# Altium schematic sheet CAPSTONE_5.0.SchDoc
size A; SheetNumber: 1; SheetTotal: 2
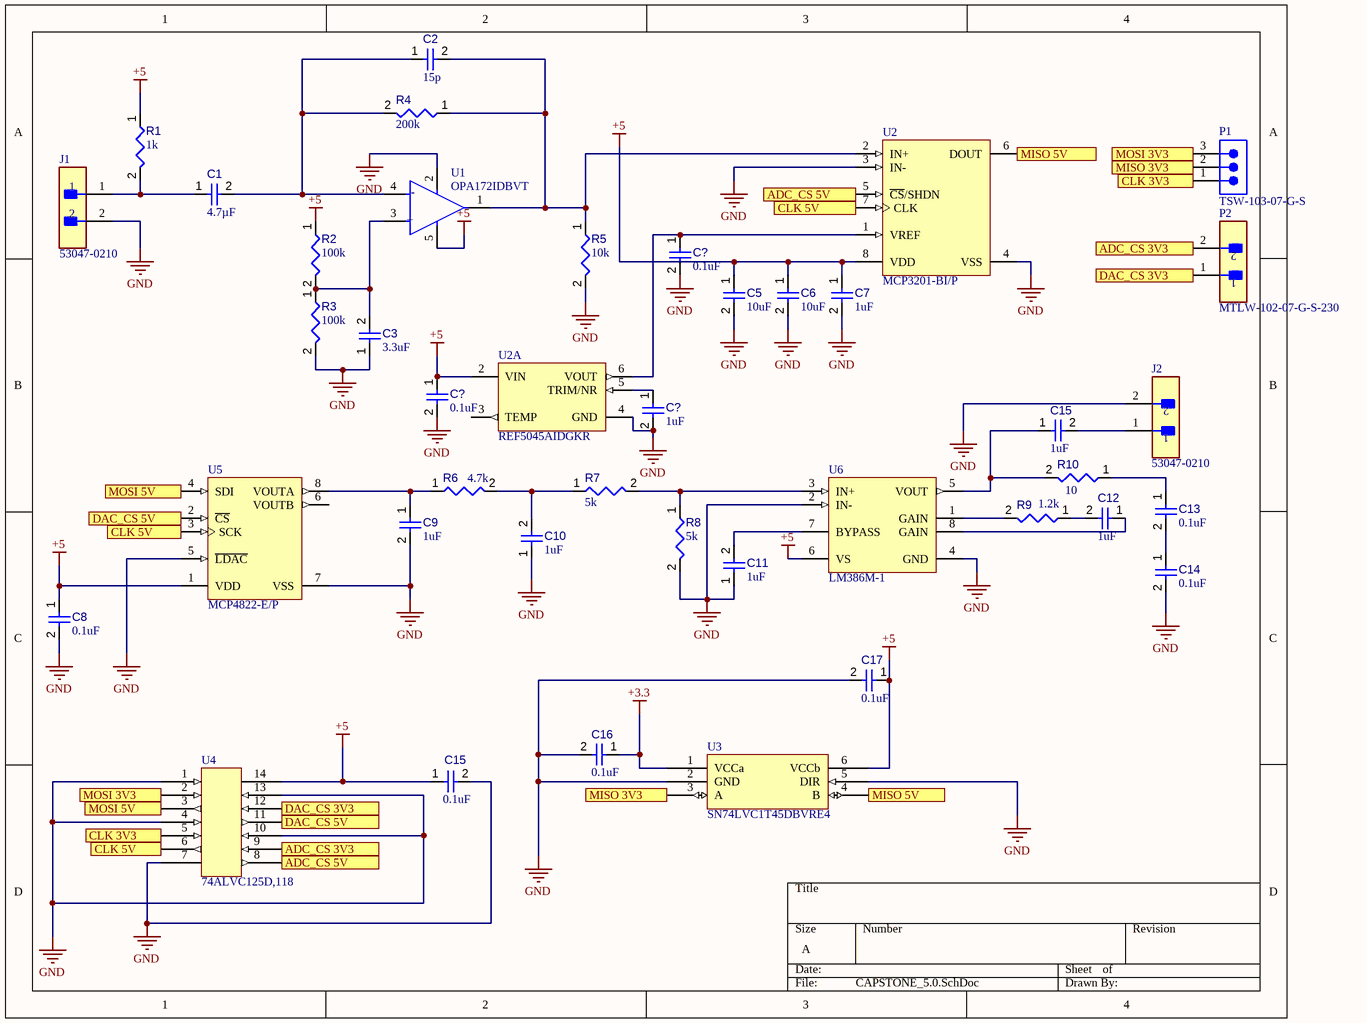
[diagram p0: CAPSTONE_5.0.SchDoc]

## Parts
(Parts that share a designator on the sheet are numbered #1, #2 ... from top to bottom, then left to right.)
C1  value 4.7µF  [CAPC0805(2012)145_L]  (hidden comment: Capacitor 4.7µF +/-40% 25V 0805)
C2  value 15p  [CAPC0805(2012)145_L]  (hidden comment: Capacitor 4.7µF +/-40% 25V 0805)
C3  value 3.3uF  [CAPC0805(2012)145_L]  (hidden comment: Capacitor 4.7µF +/-40% 25V 0805)
C5  value 10uF  [CAPC0805(2012)145_L]  (hidden comment: Capacitor 4.7µF +/-40% 25V 0805)
C6  value 10uF  [CAPC0805(2012)145_L]  (hidden comment: Capacitor 4.7µF +/-40% 25V 0805)
C7  value 1uF  [CAPC0805(2012)145_L]  (hidden comment: Capacitor 4.7µF +/-40% 25V 0805)
C8  value 0.1uF  [CAPC0805(2012)145_L]  (hidden comment: Capacitor 4.7µF +/-40% 25V 0805)
C9  value 1uF  [CAPC0805(2012)145_L]  (hidden comment: Capacitor 4.7µF +/-40% 25V 0805)
C10  value 1uF  [CAPC0805(2012)145_L]  (hidden comment: Capacitor 4.7µF +/-40% 25V 0805)
C11  value 1uF  [CAPC0805(2012)145_L]  (hidden comment: Capacitor 4.7µF +/-40% 25V 0805)
C12  value 1uF  [CAPC0805(2012)145_L]  (hidden comment: Capacitor 4.7µF +/-40% 25V 0805)
C13  value 0.1uF  [CAPC0805(2012)145_L]  (hidden comment: Capacitor 4.7µF +/-40% 25V 0805)
C14  value 0.1uF  [CAPC0805(2012)145_L]  (hidden comment: Capacitor 4.7µF +/-40% 25V 0805)
C15#1  value 1uF  [CAPC0805(2012)145_L]  (hidden comment: Capacitor 4.7µF +/-40% 25V 0805)
C15#2  value 0.1uF  [CAPC0805(2012)145_L]  (hidden comment: Capacitor 4.7µF +/-40% 25V 0805)
C16  value 0.1uF  [CAPC0805(2012)145_L]  (hidden comment: Capacitor 4.7µF +/-40% 25V 0805)
C17  value 0.1uF  [CAPC0805(2012)145_L]  (hidden comment: Capacitor 4.7µF +/-40% 25V 0805)
C?#1  value 0.1uF  [CAPC0805(2012)145_L]  (hidden comment: Capacitor 4.7µF +/-40% 25V 0805)
C?#2  value 0.1uF  [CAPC0805(2012)145_L]  (hidden comment: Capacitor 4.7µF +/-40% 25V 0805)
C?#3  value 1uF  [CAPC0805(2012)145_L]  (hidden comment: Capacitor 4.7µF +/-40% 25V 0805)
J1  53047-0210  [FP-53047-0210-MFG]
J2  53047-0210  [FP-53047-0210-MFG]
P1  TSW-103-07-G-S  [SMTC-TSW-103-07-X-S]
P2  MTLW-102-07-G-S-230  [FP-MTLW-102-07-G-S-230-MFG]
R1  value 1k  [RESC2013X70X40ML20T20]  (hidden comment: Resistor 100k +/-1% 0805 125 mW)
R2  value 100k  [RESC2013X70X40ML20T20]  (hidden comment: Resistor 100k +/-1% 0805 125 mW)
R3  value 100k  [RESC2013X70X40ML20T20]  (hidden comment: Resistor 100k +/-1% 0805 125 mW)
R4  value 200k  [RESC2013X70X40ML20T20]  (hidden comment: Resistor 100k +/-1% 0805 125 mW)
R5  value 10k  [RESC2013X70X40ML20T20]  (hidden comment: Resistor 100k +/-1% 0805 125 mW)
R6  value 4.7k  [RESC2013X70X40ML20T20]  (hidden comment: Resistor 4k7 +/-1% 0805 125 mW)
R7  value 5k  [RESC2013X70X40ML20T20]  (hidden comment: Resistor 100k +/-1% 0805 125 mW)
R8  value 5k  [RESC2013X70X40ML20T20]  (hidden comment: Resistor 100k +/-1% 0805 125 mW)
R9  value 1.2k  [RESC2013X70X40ML20T20]  (hidden comment: Resistor 100k +/-1% 0805 125 mW)
R10  value 10  [RESC2013X70X40ML20T20]  (hidden comment: Resistor 100k +/-1% 0805 125 mW)
U1  OPA172IDBVT  [FP-DBV0005A-MFG]
U2#1  MCP3201-BI/P  [PDIP300-P8]
U2#2  REF5045AIDGKR  [DGK0008A_N]  (part A of 2)
U3  SN74LVC1T45DBVRE4  [SOT65P210X110-6N]
U4  74ALVC125D,118  [SOIC127P600X175-14N]
U5  MCP4822-E/P  [PDIP300-P8]
U6  LM386M-1  [D0008A_M]

## Ports
ADC_CS 3V3 (in, see CAPSTONE_5.0[4A]), ADC_CS 3V3 (out, see CAPSTONE_5.0[1D]), ADC_CS 5V (in, see CAPSTONE_5.0[1D]), ADC_CS 5V (out, see CAPSTONE_5.0[3A]), CLK 3V3 (in, see CAPSTONE_5.0[4A]), CLK 3V3 (out, see CAPSTONE_5.0[1D]), CLK 5V (in, see CAPSTONE_5.0[1C], CAPSTONE_5.0[1D]), CLK 5V (in, see CAPSTONE_5.0[1D], CAPSTONE_5.0[3A]), CLK 5V (out, see CAPSTONE_5.0[1C], CAPSTONE_5.0[3A]), DAC_CS 3V3 (in, see CAPSTONE_5.0[4B]), DAC_CS 3V3 (out, see CAPSTONE_5.0[1D]), DAC_CS 5V (in, see CAPSTONE_5.0[1D]), DAC_CS 5V (out, see CAPSTONE_5.0[1C]), MISO 3V3 (in, see CAPSTONE_5.0[2D]), MISO 3V3 (out, see CAPSTONE_5.0[4A]), MISO 5V (in, see CAPSTONE_5.0[4A]), MISO 5V (out, see CAPSTONE_5.0[3D]), MOSI 3V3 (in, see CAPSTONE_5.0[4A]), MOSI 3V3 (out, see CAPSTONE_5.0[1D]), MOSI 5V (in, see CAPSTONE_5.0[1D]), MOSI 5V (out, see CAPSTONE_5.0[1B])

## Nets
+3.3: C16.1 U3.1(VCCa)
+5: C5.1 C6.1 C7.1 C8.1 C15#2.1 C17.1 C?#2.1 R1.1 R2.1 U1.5(V+) U2#1.8(VDD) U2#2.2(VIN) U3.6(VCCb) U4.14 U5.1(VDD) U6.6(VS)
GND: C3.1 C5.2 C6.2 C7.2 C8.2 C9.2 C10.1 C11.1 C14.2 C15#2.2 C16.2 C17.2 C?#1.2 C?#2.2 C?#3.2 J1.2 J2.2 R3.2 R5.2 R8.2 U1.2(V-) U2#1.3(IN-) U2#1.4(VSS) U2#2.4(GND) U3.2(GND) U3.5(DIR) U4.1 U4.4 U4.7 U4.10 U4.13 U5.5(~{LDAC}) U5.7(VSS) U6.2(IN-) U6.4(GND)
ADC_CS 3V3: P2.2 U4.9 ; port ADC_CS 3V3
ADC_CS 5V: U2#1.5(~{CS}/SHDN) U4.8 ; port ADC_CS 5V
CLK 3V3: P1.1 U4.5 ; port CLK 3V3
CLK 5V: U2#1.7(CLK) U4.6 U5.3(SCK) ; port CLK 5V
DAC_CS 3V3: P2.1 U4.12 ; port DAC_CS 3V3
DAC_CS 5V: U4.11 U5.2(~{CS}) ; port DAC_CS 5V
MISO 3V3: P1.2 U3.3(A) ; port MISO 3V3
MISO 5V: U2#1.6(DOUT) U3.4(B) ; port MISO 5V
MOSI 3V3: P1.3 U4.2 ; port MOSI 3V3
MOSI 5V: U4.3 U5.4(SDI) ; port MOSI 5V
NetC1_1: C1.1 J1.1 R1.2
NetC1_2: C1.2 C2.1 R4.2 U1.4(-IN)
NetC2_2: C2.2 R4.1 R5.1 U1.1(OUT) U2#1.2(IN+)
NetC3_2: C3.2 R2.2 R3.1 U1.3(+IN)
NetC9_1: C9.1 R6.1 U5.8(VOUTA)
NetC10_2: C10.2 R6.2 R7.1
NetC11_2: C11.2 U6.7(BYPASS)
NetC12_1: C12.1 U6.8(GAIN)
NetC12_2: C12.2 R9.1
NetC13_1: C13.1 R10.1
NetC13_2: C13.2 C14.1
NetC15#1_1: C15#1.1 R10.2 U6.5(VOUT)
NetC15#1_2: C15#1.2 J2.1
NetC?#1_1: C?#1.1 U2#1.1(VREF) U2#2.6(VOUT)
NetC?#3_1: C?#3.1 U2#2.5(TRIM/NR)
NetR7_2: R7.2 R8.1 U6.3(IN+)
NetR9_2: R9.2 U6.1(GAIN)

Not connected (* = marked no-connect by the designer): U2#2 3(TEMP); U5 6(VOUTB)

## Notes on the sheet
- (in symbol CMP-04893-000008-1) -; +

## Library data of the parts
C1-C3 C5-C14 C15#1 C15#2 C16 C17 C?#1-C?#3 = CMP-001-00080-4: Chip Capacitor, 4.7µF +/-40%, 25V, 0805, Thickness 1.45 mm; Tolerance: 20%; Voltage Rating: 25V; Min Operating Temperature: -55°C; Max Operating Temperature: 85°C; Pins: 2; Mounting Technology: SMT; Case/Package: 0805
J1 J2 = CMP-2000-05628-3: CONN HEADER VERT 2POS 1.25MM; Manufacturer: Molex; Conn Gender: Male; Voltage Rating: 125V; Conn Orientation: Vertical; Number Of Contacts: 2; Current Rating: 1A; Contact Material: Tin; Temperature Range Low: -40°C; ComponentLink2URL: http://www.molex.com/webdocs/datasheets/pdf/en-us/0530470210_PCB_HEADERS.pdf; Mouser Description: 1.25mm Pitch PicoBlade™ Wire-to-Board Header, Vertical, with Friction Lock, 2 Circuits; Manufacturer Part Number: 53047-0210; Temperature Range High: +85°C; ComponentLink2Description: Datasheet; Automotive: No; RoHS: TRUE; Ambient Temperature Range High: +85°C; Octopart: https://octopart.com/53047-0210-molex-276772; Footprint Url: https://www.molex.com/pdm_docs/sd/530470210_sd.pdf; Lead Free: Yes; Pitch: 1.25mm; Temperature: -40°C to +85°C; Device Class L2: Headers and Wire Housings; Package: 0; Ambient Temperature Range Low: -40°C; Digikey Description: CONN HEADER VERT 2POS 1.25MM; Category: Conn; Device Class L3: unset; Number Of Rows: 1; Device Class L1: Connectors; Height: 4.4mm
P1 = CMP-1024-00333-1: 0.025" SQ Post Header, Through-hole, Vertical, -55 to 125 degC, 2.54 mm Pitch, 3-Pin, Male, RoHS; Manufacturer: Samtec; Pitch: 2.54 mm; ComponentLink3URL: http://www.samtec.com/documents/webfiles/cpdf/TSW-XXX-XX-XXX-X-XX-XXX-MKT.pdf; Temperature Range: -55 to 125 degC; DatasheetVersion: F-214; ComponentLink1Description: Manufacturer URL; ComponentLink2URL: http://www.samtec.com/documents/webfiles/pdf/TSW_TH.PDF; RoHS: True; Orientation: Vertical; ComponentLink2Description: Datasheet; ComponentLink3Description: Package Specification; PackageDescription: .025[0.64] SQ. Post Terminal Strip Assembly; Mounting Technology: Through-hole; PackageVersion: DM, 8/1988; ComponentLink1URL: http://www.samtec.com; PackageReference: TSW-103-07-X-S; PartNumber: TSW-103-07-G-S
P2 = CMP-02766-001053-1: CONN HEADER VERT 2POS 2.54MM; Max Current Rating: 3A; Number of Contacts: 2; Gender: Male; Housing Color: Black; Housing Material: Polymer; Radiation Hardening: No; Min Operating Temperature: -55°C; Contact Plating: Gold; Termination: Solder; Number of Rows: 1; Max Operating Temperature: 125°C; Contact Material: Bronze; Pitch: 2.54mm; Depth: 2.48mm; Length: 5.08mm; Orientation: Straight; Packaging: Bulk
R1-R5 R7-R10 = CMP-009-00024-5: Chip Resistor, 100 KOhm, +/- 1%, 0.125 W, -55 to 155 degC, 0805 (2012 Metric); Power: 125mW; Voltage Rating: 150V; Max Operating Temperature: 155°C; Mounting Technology: SM; RoHS Compliant: True; Tolerance: 1%; Case/Package: 0805; Min Operating Temperature: -55°C; Pins: 2
R6 = CMP-009-00032-5: Chip Resistor, 4.7 KOhm, +/- 1%, 0.125 W, -55 to 155 degC, 0805 (2012 Metric); Power: 125mW; Voltage Rating: 150V; Max Operating Temperature: 155°C; Min Operating Temperature: -55°C; Case/Package: 0805; RoHS Compliant: True; Pins: 2; Tolerance: 1%; Mounting Technology: SM
U1 = CMP-04893-000008-1: IC OPAMP GP 1 CIRCUIT SOT23-5; Gain Bandwidth Product: 10MHz; Max Supply Voltage: 36V; Number of Circuits: 1; Max Dual Supply Voltage: 18V; Operating Supply Current: 1.6mA; Output Current per Channel: 75mA; Min Dual Supply Voltage: 2.25V; Common Mode Rejection Ratio: 90dB; Voltage Gain: 130dB; Input Bias Current: 8pA; Slew Rate: 10V/µs; Min Supply Voltage: 4.5V; Input Offset Voltage (Vos): 200uV; Packaging: Cut Tape; Max Operating Temperature: 125°C; Number of Channels: 1; RoHS Compliant: Yes; REACH SVHC: No SVHC; Number of Amplifiers: 1; Lead Free: Lead Free; Number of Pins: 5; Mount: Surface Mount; Case/Package: SOT-23-5; Min Operating Temperature: -40°C; Bandwidth: 10MHz
U2#1 = CMP-0188-00242-2: 2.7V 12-Bit A/D Converter with SPI Serial Interface, 8-Pin PDIP, B Performance Grade, Industrial Temperature; DatasheetVersion: revF, Aug-2011; ComponentLink3URL: http://www.microchip.com/stellent/groups/techpub_sg/documents/packagingspec/en012702.pdf; RevisionNote: URLs added. DatasheetVersion updated.; Code_JEDEC: MS-001; ComponentLink2Description: Datasheet; ComponentLink3Description: Package Specification; ComponentLink1URL: http://www.microchip.com/; PackageDescription: 8-Lead Plastic Dual In-Line (P) - 300 mil Body [PDIP]; ComponentLink2URL: http://ww1.microchip.com/downloads/en/DeviceDoc/21290F.pdf; PackageVersion: revBB, Aug-2009; PackageReference: PDIP300-P8; ComponentLink1Description: Manufacturer URL
U2#2 = CMP-0367-00272-2: Low Noise, Very Low Drift, Precision Voltage Reference, -40 to 125 degC, 8-pin MSOP (DGK), Green (RoHS & no Sb/Br); Manufacturer: Texas Instruments; Initial Accuracy @ 25/deg C(%): 0.05; VO(V): 4.5; VI(Max)(V): 18; SubFamily: Series Voltage Reference; Temp Coeff(Max)(ppm/ degree C): 3; VI(Min)(V): 4.7; Iq(Max)(uA): 1000; Iout/Iz(Max)(mA): 10; Rating: Catalog; DatasheetVersion: SBOS410E; ComponentLink3URL: http://www.ti.com/litv/pdf/mpds028d; ComponentLink2URL: http://www.ti.com/general/docs/lit/getliterature.tsp?genericPartNumber=REF5045&fileType=pdf; Eco-Plan: Green (RoHS & no Sb/Br); ComponentLink1URL: http://www.ti.com/; Code_JEDEC: MO-187; ComponentLink3Description: Package Specification; PackageReference: DGK0008A; ComponentLink2Description: Datasheet; PackageVersion: 4073329/E; Mounting Technology: Surface Mount; PackageDescription: 8-Pin Thin Small Outline Package 3 x 3 mm Body ,0.65 mm Pitch; ComponentLink1Description: Manufacturer URL; PartNumber: REF5045AIDGKR
U3 = CMP-015-00011-1: Single-Bit Dual-Supply Bus Transceiver with Configurable Voltage-Level Shifting and 3-State Outputs 6-SOT-23 -40 to 85; Max Supply Voltage: 5.5V; Min Supply Voltage: 1.65V; Pins: 6; Max Operating Temperature: 85°C; Case/Package: SOT-23; Mounting Technology: Surface Mount; Min Operating Temperature: -40°C
U4 = CMP-015-00010-1: Buffer / Line Driver, Non Inverting, 74ALVC125, 4 Element, 1.65 V to 3.6 V, 14 Pins, SOIC; Max Supply Voltage: 3.6V; Min Supply Voltage: 1.65V; Max Operating Temperature: 85°C; Mounting Technology: Surface Mount; Min Operating Temperature: -40°C; Case/Package: SO; Pins: 14
U5 = CMP-0188-00222-2: 12-Bit DACs with Internal VREF and SPI Interface, 8-Pin PDIP, Extended Temperature; PackageDescription: 8-Lead Plastic Dual In-Line (P) - 300 mil Body [PDIP]; PackageVersion: revBB, Aug-2009; Code_JEDEC: MS-001; ComponentLink3Description: Package Specification; RevisionNote: URLs added. DatasheetVersion updated. Sch updated.; ComponentLink1Description: Manufacturer URL; ComponentLink3URL: http://www.microchip.com/stellent/groups/techpub_sg/documents/packagingspec/en012702.pdf; DatasheetVersion: revA, Apr-2010; ComponentLink2URL: http://ww1.microchip.com/downloads/en/DeviceDoc/22249A.pdf; ComponentLink1URL: http://www.microchip.com/; ComponentLink2Description: Datasheet; PackageReference: PDIP300-P8
U6 = CMP-0057-00421-4: Low Voltage Audio Power Amplifier, 8-pin Narrow SOIC; Manufacturer: Texas Instruments; PackageTopMarking: NSZXTT*LM386*M-1; CompType: Audio IC; PowerWise: N; ComponentLink1Description: Datasheet URL; Code_IPC: SOIC127P600-8; PackageDescription: SOIC Narrow, 4.9 x 3.9 x 1.45mm, 8 Lead, 1.27mm Pitch; Code_JEDEC: MS-012-AA; PinCount: 8; ComponentLink1URL: http://www.ti.com/general/docs/lit/getliterature.tsp?genericPartNumber=LM386&fileType=pdf; RoHS: N; PackageReference: D0008A